# EAGLE design i2c_7_segx4_display (EAGLE 6.5.0)
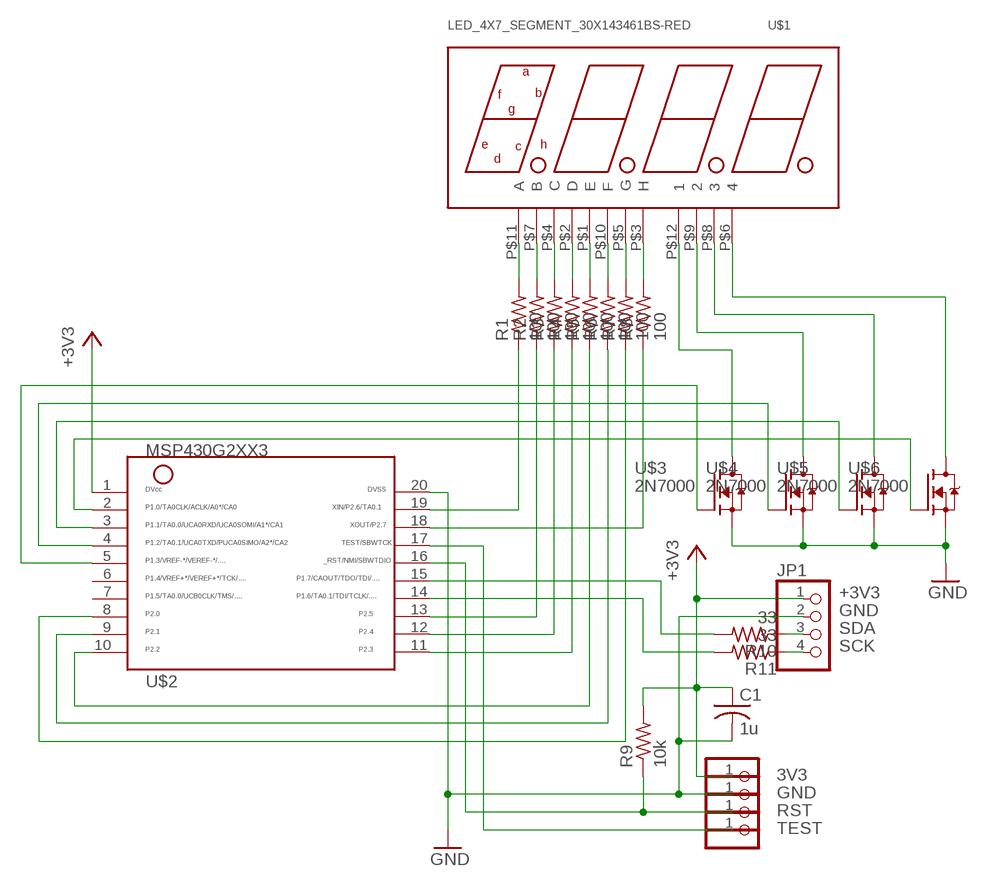
[diagram p0: schematic, sheet 1]

## Parts
3V3  PINHD-1X1  [1X01]
C1  1u  C-USC0805K  [C0805K]
GND  PINHD-1X1  [1X01]
JP1  PINHD-1X4  [1X04]
R1  100  R-US_R0603  [R0603]
R2  100  R-US_R0603  [R0603]
R3  100  R-US_R0603  [R0603]
R4  100  R-US_R0603  [R0603]
R5  100  R-US_R0603  [R0603]
R6  100  R-US_R0603  [R0603]
R7  100  R-US_R0603  [R0603]
R8  100  R-US_R0603  [R0603]
R9  10k  R-US_R0603  [R0603]
R10  33  R-US_R0603  [R0603]
R11  33  R-US_R0603  [R0603]
RST  PINHD-1X1  [1X01]
TEST  PINHD-1X1  [1X01]
U$1  LED_4X7_SEGMENT_30X143461BS-RED  [LED_4X7_SEGMENT_30X14]
U$2  G2553  G2XX3---PW20  [PW20]
U$3  2N7000  [SOT23]
U$4  2N7000  [SOT23]
U$5  2N7000  [SOT23]
U$6  2N7000  [SOT23]

## Nets
+3V3: 3V3.1 C1.1 JP1.1 R9.2 U$2.1
GND: C1.2 GND.1 JP1.2 U$2.20 U$3.2(S) U$4.2(S) U$5.2(S) U$6.2(S)
N$1: R1.2 U$1.P$11(A)
N$2: R2.2 U$1.P$7(B)
N$3: R3.2 U$1.P$4(C)
N$4: R4.2 U$1.P$2(D)
N$5: R5.2 U$1.P$1(E)
N$6: R6.2 U$1.P$10(F)
N$7: R7.2 U$1.P$5(G)
N$8: R8.2 U$1.P$3(H)
N$9: R1.1 U$2.19
N$10: R2.1 U$2.13
N$11: R3.1 U$2.12
N$12: R4.1 U$2.11
N$13: R8.1 U$2.18
N$14: R5.1 U$2.10
N$15: R6.1 U$2.9
N$16: R7.1 U$2.8
N$17: U$2.2 U$6.1(G)
N$18: U$1.P$12 U$3.3(D)
N$19: U$1.P$9 U$4.3(D)
N$20: U$1.P$8 U$5.3(D)
N$21: U$1.P$6 U$6.3(D)
N$22: U$2.3 U$5.1(G)
N$23: U$2.4 U$4.1(G)
N$24: U$2.5 U$3.1(G)
N$25: R9.1 RST.1 U$2.16
N$26: TEST.1 U$2.17
SCK: JP1.4 R11.1
SCKX: R11.2 U$2.14
SDA: JP1.3 R10.1
SDAX: R10.2 U$2.15
Unconnected: U$2.6 U$2.7

## Library data of the parts
3V3 GND RST TEST = pinhead:PINHD-1X1: PIN HEADER
C1 = resistor:C-US: CAPACITOR, American symbol
JP1 = pinhead:PINHD-1X4: PIN HEADER
R1-R11 = resistor:R-US_: RESISTOR, American symbol
U$1 = AMJ:LED_4X7_SEGMENT_30X14
U$2 = TI_MSP430_v16:G2XX3---PW20: MSP430G2XX1 TSSOP (PW) 20 Pin Package
U$3-U$6 = AMJ:2N7000: Vds 60V; Rds 2; Id 115mA

## Board
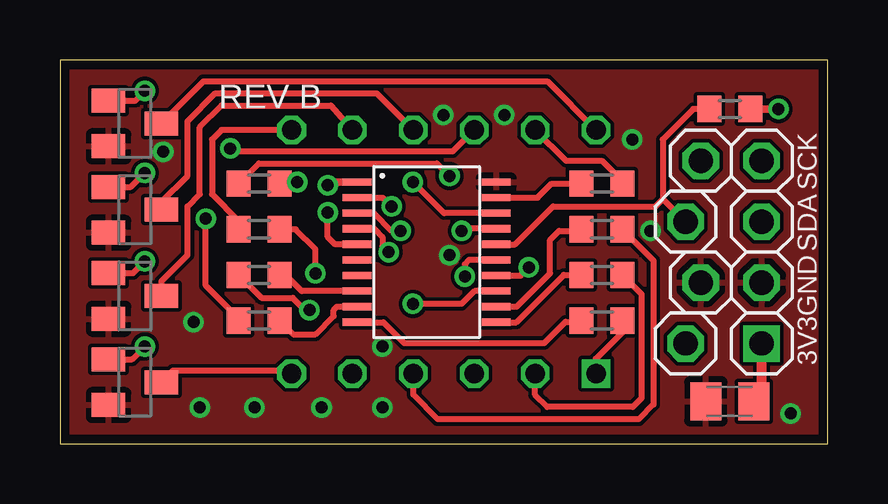
[diagram p1: board, top side]
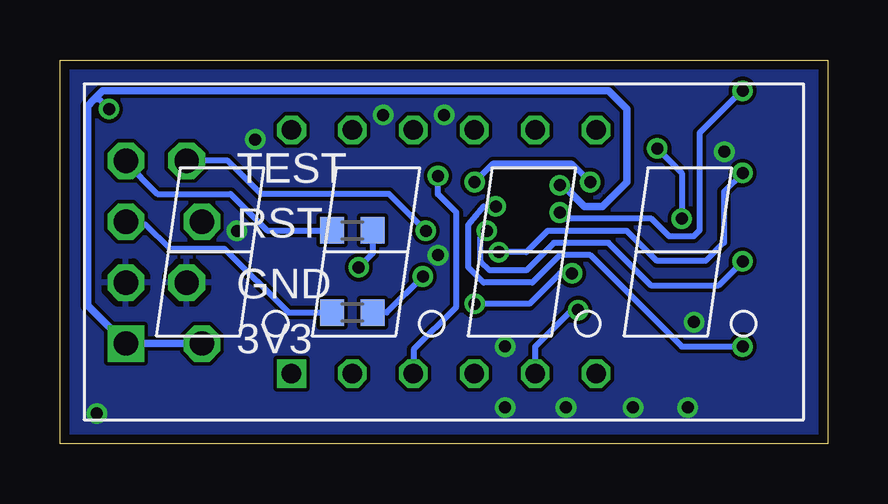
[diagram p2: board, bottom side, seen from below]

Size 32 x 16 mm. Coordinates in mm from the lower left corner, seen from the top.
Outline: 0,0 32,0 32,16 0,16 0,0
Copper layers (1*16): Top 0.0356mm / dielectric 1.5011mm / Bottom 0.0356mm
Design rules "LaenPCBOrder": minimum track width 6mil, minimum drill 13mil, track to track 6mil, track to pad 6mil, pad to pad 6mil, via to via 6mil, smd to smd 6mil, copper to edge 15mil, drill to drill 6mil, minimum pad ring 7mil, minimum via ring 7mil, stop-mask expansion 4mil, vias tented up to drill 20mil, thermal gap 10mil

### Footprints (pad centres in the part's own frame; a part is rotated, then mirrored left to right if it is on the bottom)
1X01 = drill 1.016 octagon: 1 0,0
C0805K = smd 1.3 x 1.6: 1 -1,0; 2 1,0
1X04 = drill 1.016 square: 1 -3.81,0 | drill 1.016 octagon: 2 -1.27,0; 3 1.27,0; 4 3.81,0
R0603 = smd 1 x 1.1: 1 -0.85,0; 2 0.85,0
LED_4X7_SEGMENT_30X14 = drill 0.8 square: P$1 -6.35,-5.08 | drill 0.8 octagon: P$2 -3.81,-5.08; P$3 -1.27,-5.08; P$4 1.27,-5.08; P$5 3.81,-5.08; P$6 6.35,-5.08; P$7 6.35,5.08; P$8 3.81,5.08; P$9 1.27,5.08; P$10 -1.27,5.08; P$11 -3.81,5.08; P$12 -6.35,5.08
PW20 = smd 0.3 x 1.2: 1 -2.925,-2.9; 2 -2.275,-2.9; 3 -1.625,-2.9; 4 -0.975,-2.9; 5 -0.325,-2.9; 6 0.325,-2.9; 7 0.975,-2.9; 8 1.625,-2.9; 9 2.275,-2.9; 10 2.925,-2.9; 11 2.925,2.9; 12 2.275,2.9; 13 1.625,2.9; 14 0.975,2.9; 15 0.325,2.9; 16 -0.325,2.9; 17 -0.975,2.9; 18 -1.625,2.9; 19 -2.275,2.9; 20 -2.925,2.9
SOT23 = smd 1 x 1.4: 1 -0.95,-1.1; 2 0.95,-1.1; 3 0,1.1

### Placement (x,y rotation side)
3V3  26.08,4.17 270 top
C1  27.92,1.76 180 top
GND  26.72,6.71 270 top
JP1  29.26,7.99 90 top
R1  22.59,10.84 0 top
R2  8.3,8.94 180 top
R3  22.59,8.94 0 top
R4  22.59,7.03 0 top
R5  22.59,5.13 0 top
R6  8.3,5.13 180 top
R7  8.3,7.03 180 top
R8  8.3,10.84 180 top
R9  27.92,13.95 0 top
R10  19.81,5.46 0 bottom
R11  19.81,8.89 0 bottom
RST  26.08,9.26 270 top
TEST  26.72,11.79 270 top
U$1  16,8 0 bottom
U$2  15.29,7.99 270 top
U$3  3.13,13.35 270 top
U$4  3.13,9.75 270 top
U$5  3.13,6.16 270 top
U$6  3.13,2.56 270 top

### Tracks (layer width: path | path; a pad name or v marks a point on that pad's centre or on a via)
+3V3  (via drill 0.5)
  Top 0.305: U$2.1 11.29,10.91 v11.16,10.78 | R9.2 v29.96,13.95
  Top 0.406: C1.1 29.26,2.1 JP1.1
  Bottom 0.254: v29.96,13.95 30.34,14.34 30.59,14.34
  Bottom 0.305: v11.16,10.78 11.03,10.78 10.14,9.89 9.38,9.89 8.37,10.91 8.37,13.95 9.13,14.72 30.21,14.72 30.59,14.34 30.84,14.08 30.84,5.76 JP1.1 3V3.1
GND  (via drill 0.5)
  other vias: 16.24,7.86 5.57,5.06 5.83,1.51 4.3,12.18 13.45,4.05 30.46,1.25 8.11,1.51 10.91,1.51 13.45,1.51 18.53,13.7 15.99,13.7 23.86,12.68 24.62,8.87
  pour Bottom: -0.27,-0.27 32.75,-0.27 32.75,16.51 -0.27,16.51
  pour Top: -0.27,-0.27 32.75,-0.27 32.75,16.24 -0.27,16.24
N$1
  Top 0.254: R1.2 23.44,10.95 22.59,11.79 21.09,11.79 U$1.P$11
N$2
  Top 0.254: U$1.P$7 6.73,13.08 6.33,12.68 6.33,10.4 7.45,9.28 R2.2
N$3
  Top 0.254: R3.2 24.75,7.63 24.75,1.64 24.13,1.02 15.75,1.02 14.73,2.03 U$1.P$4
N$4
  Top 0.254: R4.2 24.24,6.23 24.24,1.89 23.88,1.52 20.32,1.52 19.81,2.03 U$1.P$2
N$5
  Top 0.254: U$1.P$1 22.34,2.93 22.34,3.54 23.44,4.64 R5.2
N$6  (via drill 0.5)
  Top 0.254: 7.39,5.06 R6.2 7.45,5.21 6.08,6.59 v6.08,9.38 | v7.1,12.3 7.21,12.19 16.38,12.19 U$1.P$10
  Bottom 0.254: v7.1,12.3 6.08,11.29 v6.08,9.38
N$7  (via drill 0.5)
  Top 0.254: R7.2 8.4,6.08 9.7,6.08 10.21,5.57 v10.4,5.57
  Bottom 0.254: U$1.P$5 12.19,4.03 10.65,5.57 v10.4,5.57
N$8  (via drill 0.5)
  Top 0.254: R8.2 8.29,11.68 15.72,11.68 v16.24,11.16
  Bottom 0.254: U$1.P$3 17.26,2.93 17.26,3.92 15.48,5.7 15.48,9.64 16.24,10.4 v16.24,11.16
N$9
  Top 0.254: U$2.19 19.91,10.26 20.49,10.84 R1.1
N$10  (via drill 0.5)
  Top 0.254: v10.65,7.1 10.65,8.11 9.83,8.94 R2.1 | U$2.13 17.28,6.36 16.75,5.83 v14.72,5.83
  Bottom 0.254: v10.65,7.1 11.16,7.1 12.43,5.83 v14.72,5.83
N$11
  Top 0.254: U$2.12 19.05,5.71 20.43,7.1 20.43,8.49 20.81,8.87 21.68,8.87 R3.1
N$12
  Top 0.254: 21.64,7.03 R4.1 21,7.03 19.03,5.06 U$2.11
N$13  (via drill 0.5)
  Top 0.254: U$2.18 16.01,9.61 v14.72,10.91 | R8.1 9.83,10.84 v9.89,10.91
  Bottom 0.254: v9.89,10.91 10.65,11.67 13.95,11.67 v14.72,10.91
N$14
  Top 0.254: U$2.10 13.48,5.06 14.35,4.19 20.19,4.19 21.08,5.08 21.69,5.08 R5.1
N$15
  Top 0.254: R6.1 9.72,4.56 10.65,4.56 11.41,5.32 11.41,5.57 11.55,5.71 U$2.9
N$16
  Top 0.254: U$2.8 10.08,6.36 9.41,7.03 R7.1
N$17  (via drill 0.5)
  Top 0.254: U$2.2 13.46,10.26 v13.83,9.89 | U$6.1 3,3.51 v3.54,4.05
  Bottom 0.254: v13.83,9.89 14.34,9.89 14.97,9.13 14.97,7.35 14.34,6.71 12.3,6.71 11.16,7.86 9.89,7.86 6.08,4.05 v3.54,4.05
N$18
  Top 0.254: U$1.P$12 20.32,15.11 5.97,15.11 5.97,15.09 U$3.3
N$19
  Top 0.254: U$1.P$9 13.21,14.61 6.48,14.61 5.32,13.45 5.32,11.16 4.23,10.07 U$4.3
N$20
  Top 0.254: U$1.P$8 11.3,14.1 6.73,14.1 5.83,13.19 5.83,10.4 5.32,9.89 5.32,7.86 4.23,6.77 U$5.3
N$21
  Top 0.254: U$1.P$6 9.54,3.03 4.7,3.03 U$6.3
N$22  (via drill 0.5)
  Top 0.254: U$2.3 13.09,9.61 13.83,8.87 v14.21,8.87 | U$5.1 3.04,7.11 v3.54,7.6
  Bottom 0.254: v14.21,8.87 14.46,8.62 14.46,7.6 14.08,7.22 12.56,7.22 11.41,8.37 9.13,8.37 7.37,6.6 4.54,6.6 v3.54,7.6
N$23  (via drill 0.5)
  Top 0.254: U$2.4 13.11,8.96 13.45,8.62 13.45,8.24 v13.7,7.99 | U$4.1 2.95,10.7 v3.54,11.29
  Bottom 0.254: v13.7,7.99 12.56,7.99 11.67,8.87 8.37,8.87 7.11,7.62 5.08,7.62 4.32,8.38 4.32,10.51 v3.54,11.29
N$24  (via drill 0.5)
  Top 0.254: U$2.5 11.47,8.31 11.16,8.62 v11.16,9.64 | U$3.1 3.12,14.3 v3.54,14.72
  Bottom 0.254: v11.16,9.64 10.91,9.38 7.35,9.38 6.6,8.64 5.59,8.64 5.33,8.89 5.33,12.95 3.57,14.72 v3.54,14.72
N$25
  Top 0.254: R9.1 26.4,13.95 25.13,12.68 25.13,10.21 | 25.13,10.21 RST.1 | U$2.16 18.98,8.31 20.56,9.89 24.81,9.89 25.13,10.21
N$26  (via drill 0.5)
  Top 0.254: U$2.17 16.83,8.96 v16.75,8.87
  Bottom 0.254: TEST.1 25,11.79 23.62,10.41 18.29,10.41 v16.75,8.87
SCK
  Bottom 0.254: JP1.4 29.26,11.73 27.94,10.41 24.89,10.41 23.37,8.89 R11.1
SCKX  (via drill 0.5)
  Top 0.254: U$2.14 19.2,7.01 v19.54,7.35
  Bottom 0.254: R11.2 18.96,7.93 v19.54,7.35
SDA
  Bottom 0.254: JP1.3 29.15,9.14 28.45,9.14 27.43,8.13 25.15,8.13 22.48,5.46 R10.1
SDAX  (via drill 0.5)
  Top 0.254: U$2.15 17.06,7.66 16.88,7.48 v16.88,6.97
  Bottom 0.254: v16.88,6.97 18.38,5.46 R10.2

### Text on the board
tPlace: REV B
tNames: SCK | SDA | GND | 3V3